# Altium schematic sheet FLEX_IO.SchDoc
size A2
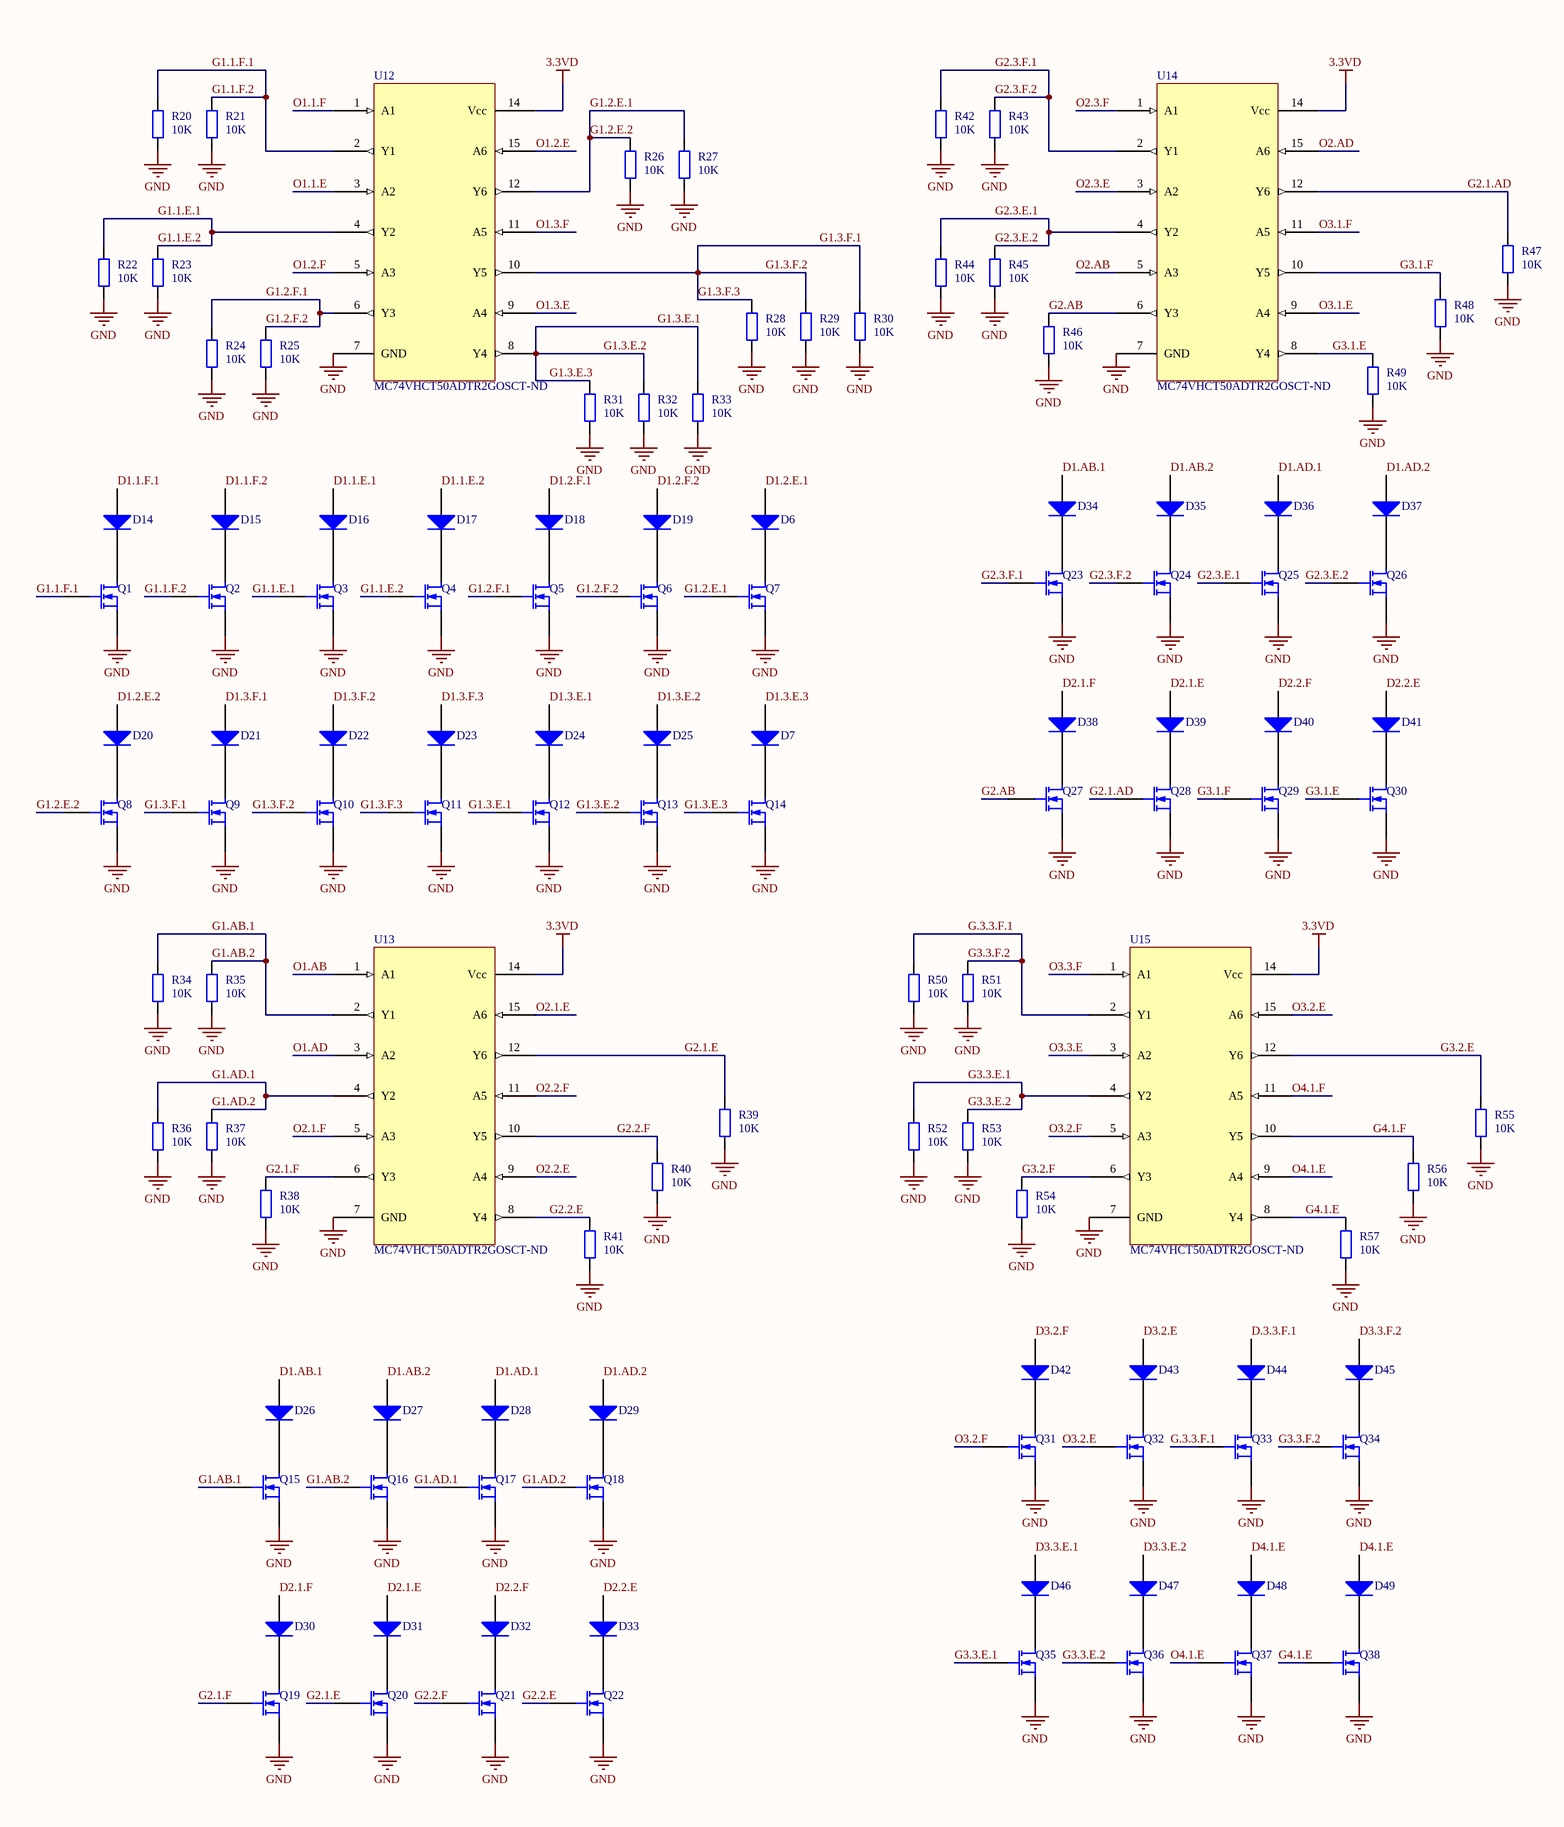
[diagram p0: FLEX_IO.SchDoc, left]
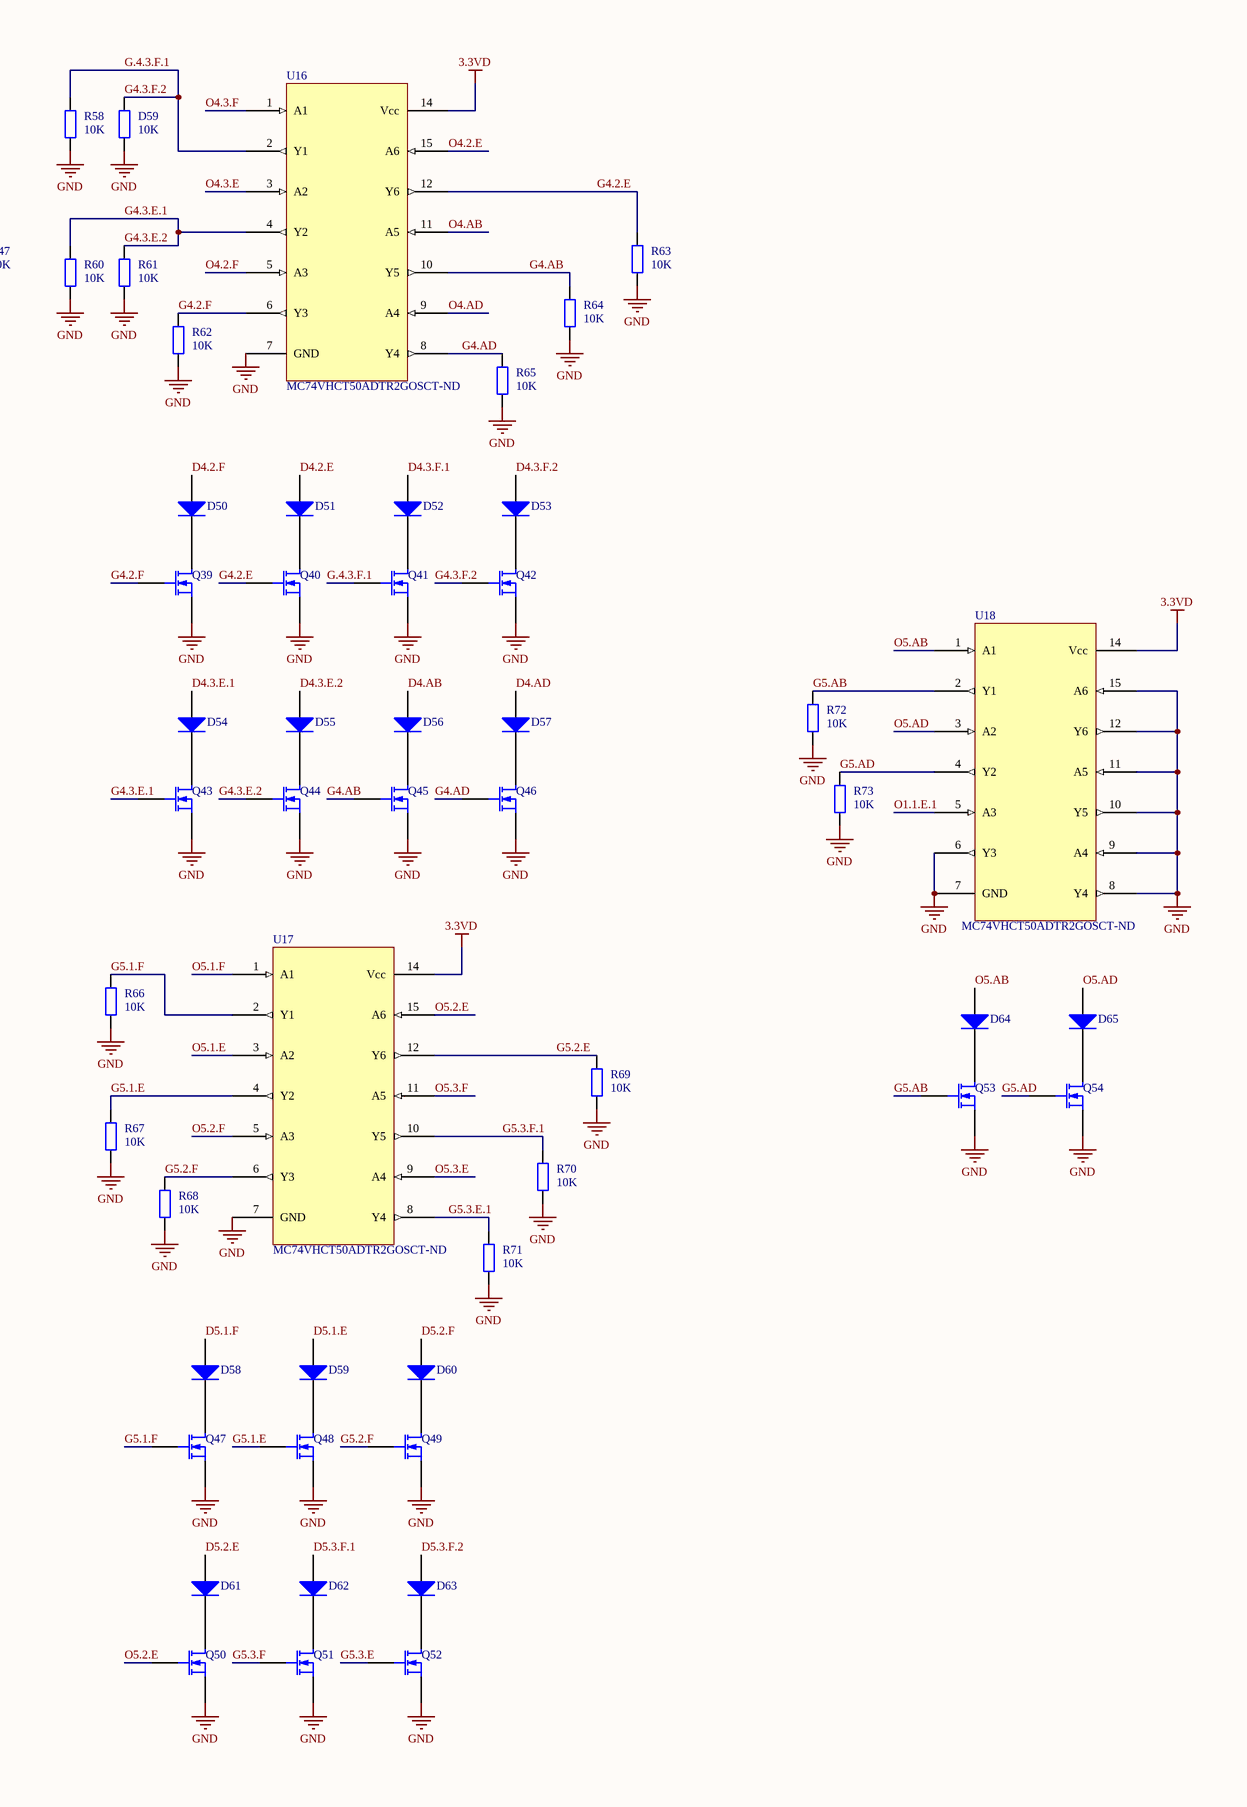
[diagram p1: FLEX_IO.SchDoc, right]

## Parts
(Parts that share a designator on the sheet are numbered #1, #2 ... from top to bottom, then left to right.)
D6  de  [SMC]  (value not drawn)
D7  de  [SMC]  (value not drawn)
D14  de  [SMC]  (value not drawn)
D15  de  [SMC]  (value not drawn)
D16  de  [SMC]  (value not drawn)
D17  de  [SMC]  (value not drawn)
D18  de  [SMC]  (value not drawn)
D19  de  [SMC]  (value not drawn)
D20  de  [SMC]  (value not drawn)
D21  de  [SMC]  (value not drawn)
D22  de  [SMC]  (value not drawn)
D23  de  [SMC]  (value not drawn)
D24  de  [SMC]  (value not drawn)
D25  de  [SMC]  (value not drawn)
D26  de  [SMC]  (value not drawn)
D27  de  [SMC]  (value not drawn)
D28  de  [SMC]  (value not drawn)
D29  de  [SMC]  (value not drawn)
D30  de  [SMC]  (value not drawn)
D31  de  [SMC]  (value not drawn)
D32  de  [SMC]  (value not drawn)
D33  de  [SMC]  (value not drawn)
D34  de  [SMC]  (value not drawn)
D35  de  [SMC]  (value not drawn)
D36  de  [SMC]  (value not drawn)
D37  de  [SMC]  (value not drawn)
D38  de  [SMC]  (value not drawn)
D39  de  [SMC]  (value not drawn)
D40  de  [SMC]  (value not drawn)
D41  de  [SMC]  (value not drawn)
D42  de  [SMC]  (value not drawn)
D43  de  [SMC]  (value not drawn)
D44  de  [SMC]  (value not drawn)
D45  de  [SMC]  (value not drawn)
D46  de  [SMC]  (value not drawn)
D47  de  [SMC]  (value not drawn)
D48  de  [SMC]  (value not drawn)
D49  de  [SMC]  (value not drawn)
D50  de  [SMC]  (value not drawn)
D51  de  [SMC]  (value not drawn)
D52  de  [SMC]  (value not drawn)
D53  de  [SMC]  (value not drawn)
D54  de  [SMC]  (value not drawn)
D55  de  [SMC]  (value not drawn)
D56  de  [SMC]  (value not drawn)
D57  de  [SMC]  (value not drawn)
D58  de  [SMC]  (value not drawn)
D59#1  value 10K  [AXIAL-0.4]
D59#2  de  [SMC]  (value not drawn)
D60  de  [SMC]  (value not drawn)
D61  de  [SMC]  (value not drawn)
D62  de  [SMC]  (value not drawn)
D63  de  [SMC]  (value not drawn)
D64  de  [SMC]  (value not drawn)
D65  de  [SMC]  (value not drawn)
Q1  (no value)
Q2  (no value)
Q3  (no value)
Q4  (no value)
Q5  (no value)
Q6  (no value)
Q7  (no value)
Q8  (no value)
Q9  (no value)
Q10  (no value)
Q11  (no value)
Q12  (no value)
Q13  (no value)
Q14  (no value)
Q15  (no value)
Q16  (no value)
Q17  (no value)
Q18  (no value)
Q19  (no value)
Q20  (no value)
Q21  (no value)
Q22  (no value)
Q23  (no value)
Q24  (no value)
Q25  (no value)
Q26  (no value)
Q27  (no value)
Q28  (no value)
Q29  (no value)
Q30  (no value)
Q31  (no value)
Q32  (no value)
Q33  (no value)
Q34  (no value)
Q35  (no value)
Q36  (no value)
Q37  (no value)
Q38  (no value)
Q39  (no value)
Q40  (no value)
Q41  (no value)
Q42  (no value)
Q43  (no value)
Q44  (no value)
Q45  (no value)
Q46  (no value)
Q47  (no value)
Q48  (no value)
Q49  (no value)
Q50  (no value)
Q51  (no value)
Q52  (no value)
Q53  (no value)
Q54  (no value)
R20  value 10K  [AXIAL-0.4]
R21  value 10K  [AXIAL-0.4]
R22  value 10K  [AXIAL-0.4]
R23  value 10K  [AXIAL-0.4]
R24  value 10K  [AXIAL-0.4]
R25  value 10K  [AXIAL-0.4]
R26  value 10K  [AXIAL-0.4]
R27  value 10K  [AXIAL-0.4]
R28  value 10K  [AXIAL-0.4]
R29  value 10K  [AXIAL-0.4]
R30  value 10K  [AXIAL-0.4]
R31  value 10K  [AXIAL-0.4]
R32  value 10K  [AXIAL-0.4]
R33  value 10K  [AXIAL-0.4]
R34  value 10K  [AXIAL-0.4]
R35  value 10K  [AXIAL-0.4]
R36  value 10K  [AXIAL-0.4]
R37  value 10K  [AXIAL-0.4]
R38  value 10K  [AXIAL-0.4]
R39  value 10K  [AXIAL-0.4]
R40  value 10K  [AXIAL-0.4]
R41  value 10K  [AXIAL-0.4]
R42  value 10K  [AXIAL-0.4]
R43  value 10K  [AXIAL-0.4]
R44  value 10K  [AXIAL-0.4]
R45  value 10K  [AXIAL-0.4]
R46  value 10K  [AXIAL-0.4]
R47  value 10K  [AXIAL-0.4]
R48  value 10K  [AXIAL-0.4]
R49  value 10K  [AXIAL-0.4]
R50  value 10K  [AXIAL-0.4]
R51  value 10K  [AXIAL-0.4]
R52  value 10K  [AXIAL-0.4]
R53  value 10K  [AXIAL-0.4]
R54  value 10K  [AXIAL-0.4]
R55  value 10K  [AXIAL-0.4]
R56  value 10K  [AXIAL-0.4]
R57  value 10K  [AXIAL-0.4]
R58  value 10K  [AXIAL-0.4]
R60  value 10K  [AXIAL-0.4]
R61  value 10K  [AXIAL-0.4]
R62  value 10K  [AXIAL-0.4]
R63  value 10K  [AXIAL-0.4]
R64  value 10K  [AXIAL-0.4]
R65  value 10K  [AXIAL-0.4]
R66  value 10K  [AXIAL-0.4]
R67  value 10K  [AXIAL-0.4]
R68  value 10K  [AXIAL-0.4]
R69  value 10K  [AXIAL-0.4]
R70  value 10K  [AXIAL-0.4]
R71  value 10K  [AXIAL-0.4]
R72  value 10K  [AXIAL-0.4]
R73  value 10K  [AXIAL-0.4]
U12  Supplier Part Number 1: MC74VHCT50ADTR2GOSCT-ND  (hidden comment: MC74VHCT50A)
U13  Supplier Part Number 1: MC74VHCT50ADTR2GOSCT-ND  (hidden comment: MC74VHCT50A)
U14  Supplier Part Number 1: MC74VHCT50ADTR2GOSCT-ND  (hidden comment: MC74VHCT50A)
U15  Supplier Part Number 1: MC74VHCT50ADTR2GOSCT-ND  (hidden comment: MC74VHCT50A)
U16  Supplier Part Number 1: MC74VHCT50ADTR2GOSCT-ND  (hidden comment: MC74VHCT50A)
U17  Supplier Part Number 1: MC74VHCT50ADTR2GOSCT-ND  (hidden comment: MC74VHCT50A)
U18  Supplier Part Number 1: MC74VHCT50ADTR2GOSCT-ND  (hidden comment: MC74VHCT50A)

## Nets
3.3VD: U12.14(Vcc) U13.14(Vcc) U14.14(Vcc) U15.14(Vcc) U16.14(Vcc) U17.14(Vcc) U18.14(Vcc)
GND: D59#1.1 Q1.3(S) Q2.3(S) Q3.3(S) Q4.3(S) Q5.3(S) Q6.3(S) Q7.3(S) Q8.3(S) Q9.3(S) Q10.3(S) Q11.3(S) Q12.3(S) Q13.3(S) Q14.3(S) Q15.3(S) Q16.3(S) Q17.3(S) Q18.3(S) Q19.3(S) Q20.3(S) Q21.3(S) Q22.3(S) Q23.3(S) Q24.3(S) Q25.3(S) Q26.3(S) Q27.3(S) Q28.3(S) Q29.3(S) Q30.3(S) Q31.3(S) Q32.3(S) Q33.3(S) Q34.3(S) Q35.3(S) Q36.3(S) Q37.3(S) Q38.3(S) Q39.3(S) Q40.3(S) Q41.3(S) Q42.3(S) Q43.3(S) Q44.3(S) Q45.3(S) Q46.3(S) Q47.3(S) Q48.3(S) Q49.3(S) Q50.3(S) Q51.3(S) Q52.3(S) Q53.3(S) Q54.3(S) R20.1 R21.1 R22.1 R23.1 R24.1 R25.1 R26.1 R27.1 R28.1 R29.1 R30.1 R31.1 R32.1 R33.1 R34.1 R35.1 R36.1 R37.1 R38.1 R39.1 R40.1 R41.1 R42.1 R43.1 R44.1 R45.1 R46.1 R47.1 R48.1 R49.1 R50.1 R51.1 R52.1 R53.1 R54.1 R55.1 R56.1 R57.1 R58.1 R60.1 R61.1 R62.1 R63.1 R64.1 R65.1 R66.1 R67.1 R68.1 R69.1 R70.1 R71.1 R72.1 R73.1 U12.7(GND) U13.7(GND) U14.7(GND) U15.7(GND) U16.7(GND) U17.7(GND) U18.6(Y3) U18.7(GND) U18.8(Y4) U18.9(A4) U18.10(Y5) U18.11(A5) U18.12(Y6) U18.15(A6)
D1.1.E.1: D16.1(A)
D1.1.E.2: D17.1(A)
D1.1.F.1: D14.1(A)
D1.1.F.2: D15.1(A)
D1.2.E.1: D6.1(A)
D1.2.E.2: D20.1(A)
D1.2.F.1: D18.1(A)
D1.2.F.2: D19.1(A)
D1.3.E.1: D24.1(A)
D1.3.E.2: D25.1(A)
D1.3.E.3: D7.1(A)
D1.3.F.1: D21.1(A)
D1.3.F.2: D22.1(A)
D1.3.F.3: D23.1(A)
D1.AB.1: D26.1(A) D34.1(A)
D1.AB.2: D27.1(A) D35.1(A)
D1.AD.1: D28.1(A) D36.1(A)
D1.AD.2: D29.1(A) D37.1(A)
D2.1.E: D31.1(A) D39.1(A)
D2.1.F: D30.1(A) D38.1(A)
D2.2.E: D33.1(A) D41.1(A)
D2.2.F: D32.1(A) D40.1(A)
D3.2.E: D43.1(A)
D3.2.F: D42.1(A)
D3.3.E.1: D46.1(A)
D3.3.E.2: D47.1(A)
D3.3.F.2: D45.1(A)
D4.1.E: D48.1(A) D49.1(A)
D4.2.E: D51.1(A)
D4.2.F: D50.1(A)
D4.3.E.1: D54.1(A)
D4.3.E.2: D55.1(A)
D4.3.F.1: D52.1(A)
D4.3.F.2: D53.1(A)
D4.AB: D56.1(A)
D4.AD: D57.1(A)
D5.1.E: D59#2.1(A)
D5.1.F: D58.1(A)
D5.2.E: D61.1(A)
D5.2.F: D60.1(A)
D5.3.F.1: D62.1(A)
D5.3.F.2: D63.1(A)
D.3.3.F.1: D44.1(A)
G1.1.E.1: Q3.2(G) Q4.2(G) R22.2 R23.2 U12.4(Y2)  [also labelled G1.1.E.2]
G1.1.F.1: Q1.2(G) Q2.2(G) R20.2 R21.2 U12.2(Y1)  [also labelled G1.1.F.2]
G1.2.E.1: Q7.2(G) Q8.2(G) R26.2 R27.2 U12.12(Y6)  [also labelled G1.2.E.2]
G1.2.F.1: Q5.2(G) Q6.2(G) R24.2 R25.2 U12.6(Y3)  [also labelled G1.2.F.2]
G1.3.E.1: Q12.2(G) Q13.2(G) Q14.2(G) R31.2 R32.2 R33.2 U12.8(Y4)  [also labelled G1.3.E.2, G1.3.E.3]
G1.3.F.1: Q9.2(G) Q10.2(G) Q11.2(G) R28.2 R29.2 R30.2 U12.10(Y5)  [also labelled G1.3.F.2, G1.3.F.3]
G1.AB.1: Q15.2(G) Q16.2(G) R34.2 R35.2 U13.2(Y1)  [also labelled G1.AB.2]
G1.AD.1: Q17.2(G) Q18.2(G) R36.2 R37.2 U13.4(Y2)  [also labelled G1.AD.2]
G2.1.AD: Q28.2(G) R47.2 U14.12(Y6)
G2.1.E: Q20.2(G) R39.2 U13.12(Y6)
G2.1.F: Q19.2(G) R38.2 U13.6(Y3)
G2.2.E: Q22.2(G) R41.2 U13.8(Y4)
G2.2.F: Q21.2(G) R40.2 U13.10(Y5)
G2.3.E.1: Q25.2(G) Q26.2(G) R44.2 R45.2 U14.4(Y2)  [also labelled G2.3.E.2]
G2.3.F.1: Q23.2(G) Q24.2(G) R42.2 R43.2 U14.2(Y1)  [also labelled G2.3.F.2]
G2.AB: Q27.2(G) R46.2 U14.6(Y3)
G3.1.E: Q30.2(G) R49.2 U14.8(Y4)
G3.1.F: Q29.2(G) R48.2 U14.10(Y5)
G3.2.E: R55.2 U15.12(Y6)
G3.2.F: R54.2 U15.6(Y3)
G3.3.E.1: Q35.2(G) Q36.2(G) R52.2 R53.2 U15.4(Y2)  [also labelled G3.3.E.2]
G4.1.E: Q38.2(G) R57.2 U15.8(Y4)
G4.1.F: R56.2 U15.10(Y5)
G4.2.E: Q40.2(G) R63.2 U16.12(Y6)
G4.2.F: Q39.2(G) R62.2 U16.6(Y3)
G4.3.E.1: Q43.2(G) Q44.2(G) R60.2 R61.2 U16.4(Y2)  [also labelled G4.3.E.2]
G4.AB: Q45.2(G) R64.2 U16.10(Y5)
G4.AD: Q46.2(G) R65.2 U16.8(Y4)
G5.1.E: Q48.2(G) R67.2 U17.4(Y2)
G5.1.F: Q47.2(G) R66.2 U17.2(Y1)
G5.2.E: R69.2 U17.12(Y6)
G5.2.F: Q49.2(G) R68.2 U17.6(Y3)
G5.3.E: Q52.2(G)
G5.3.E.1: R71.2 U17.8(Y4)
G5.3.F: Q51.2(G)
G5.3.F.1: R70.2 U17.10(Y5)
G5.AB: Q53.2(G) R72.2 U18.2(Y1)
G5.AD: Q54.2(G) R73.2 U18.4(Y2)
G.3.3.F.1: Q33.2(G) Q34.2(G) R50.2 R51.2 U15.2(Y1)  [also labelled G3.3.F.2]
G.4.3.F.1: D59#1.2 Q41.2(G) Q42.2(G) R58.2 U16.2(Y1)  [also labelled G4.3.F.2]
O1.1.E: U12.3(A2)
O1.1.E.1: U18.5(A3)
O1.1.F: U12.1(A1)
O1.2.E: U12.15(A6)
O1.2.F: U12.5(A3)
O1.3.E: U12.9(A4)
O1.3.F: U12.11(A5)
O1.AB: U13.1(A1)
O1.AD: U13.3(A2)
O2.1.E: U13.15(A6)
O2.1.F: U13.5(A3)
O2.2.E: U13.9(A4)
O2.2.F: U13.11(A5)
O2.3.E: U14.3(A2)
O2.3.F: U14.1(A1)
O2.AB: U14.5(A3)
O2.AD: U14.15(A6)
O3.1.E: U14.9(A4)
O3.1.F: U14.11(A5)
O3.2.E: Q32.2(G) U15.15(A6)
O3.2.F: Q31.2(G) U15.5(A3)
O3.3.E: U15.3(A2)
O3.3.F: U15.1(A1)
O4.1.E: Q37.2(G) U15.9(A4)
O4.1.F: U15.11(A5)
O4.2.E: U16.15(A6)
O4.2.F: U16.5(A3)
O4.3.E: U16.3(A2)
O4.3.F: U16.1(A1)
O4.AB: U16.11(A5)
O4.AD: U16.9(A4)
O5.1.E: U17.3(A2)
O5.1.F: U17.1(A1)
O5.2.E: Q50.2(G) U17.15(A6)
O5.2.F: U17.5(A3)
O5.3.E: U17.9(A4)
O5.3.F: U17.11(A5)
O5.AB: D64.1(A) U18.1(A1)
O5.AD: D65.1(A) U18.3(A2)
NetD6_2: D6.2(K) Q7.1(D)
NetD7_2: D7.2(K) Q14.1(D)
NetD14_2: D14.2(K) Q1.1(D)
NetD15_2: D15.2(K) Q2.1(D)
NetD16_2: D16.2(K) Q3.1(D)
NetD17_2: D17.2(K) Q4.1(D)
NetD18_2: D18.2(K) Q5.1(D)
NetD19_2: D19.2(K) Q6.1(D)
NetD20_2: D20.2(K) Q8.1(D)
NetD21_2: D21.2(K) Q9.1(D)
NetD22_2: D22.2(K) Q10.1(D)
NetD23_2: D23.2(K) Q11.1(D)
NetD24_2: D24.2(K) Q12.1(D)
NetD25_2: D25.2(K) Q13.1(D)
NetD26_2: D26.2(K) Q15.1(D)
NetD27_2: D27.2(K) Q16.1(D)
NetD28_2: D28.2(K) Q17.1(D)
NetD29_2: D29.2(K) Q18.1(D)
NetD30_2: D30.2(K) Q19.1(D)
NetD31_2: D31.2(K) Q20.1(D)
NetD32_2: D32.2(K) Q21.1(D)
NetD33_2: D33.2(K) Q22.1(D)
NetD34_2: D34.2(K) Q23.1(D)
NetD35_2: D35.2(K) Q24.1(D)
NetD36_2: D36.2(K) Q25.1(D)
NetD37_2: D37.2(K) Q26.1(D)
NetD38_2: D38.2(K) Q27.1(D)
NetD39_2: D39.2(K) Q28.1(D)
NetD40_2: D40.2(K) Q29.1(D)
NetD41_2: D41.2(K) Q30.1(D)
NetD42_2: D42.2(K) Q31.1(D)
NetD43_2: D43.2(K) Q32.1(D)
NetD44_2: D44.2(K) Q33.1(D)
NetD45_2: D45.2(K) Q34.1(D)
NetD46_2: D46.2(K) Q35.1(D)
NetD47_2: D47.2(K) Q36.1(D)
NetD48_2: D48.2(K) Q37.1(D)
NetD49_2: D49.2(K) Q38.1(D)
NetD50_2: D50.2(K) Q39.1(D)
NetD51_2: D51.2(K) Q40.1(D)
NetD52_2: D52.2(K) Q41.1(D)
NetD53_2: D53.2(K) Q42.1(D)
NetD54_2: D54.2(K) Q43.1(D)
NetD55_2: D55.2(K) Q44.1(D)
NetD56_2: D56.2(K) Q45.1(D)
NetD57_2: D57.2(K) Q46.1(D)
NetD58_2: D58.2(K) Q47.1(D)
NetD59#2_2: D59#2.2(K) Q48.1(D)
NetD60_2: D60.2(K) Q49.1(D)
NetD61_2: D61.2(K) Q50.1(D)
NetD62_2: D62.2(K) Q51.1(D)
NetD63_2: D63.2(K) Q52.1(D)
NetD64_2: D64.2(K) Q53.1(D)
NetD65_2: D65.2(K) Q54.1(D)

## Library data of the parts
D6 D7 D14-D58 D59#2 D60-D65 = Diode: Default Diode; Published: 8-Jun-2000; LatestRevisionDate: 17-Jul-2002; LatestRevisionNote: Re-released for DXP Platform.; PackageVersion: Sep-1996; PackageReference: SMC; Publisher: Altium Limited; PackageDescription: DO-214-AB/SMC; 2 C-Bend Leads; Body 7.9 x 5.9 mm, inc. leads (LxW); Code_JEDEC: DO-214-AB; Supplier 1: Digi-Key; Supplier Part Number 1: 1727-5384-1-ND
D59#1 R20-R58 R60-R73 = Res2: Resistor; Published: 8-Jun-2000; LatestRevisionDate: 17-Jul-2002; LatestRevisionNote: Re-released for DXP Platform.; PackageReference: AXIAL-0.4; Publisher: Altium Limited; PackageDescription: Axial Device, Thru-Hole; 2 Leads; 0.4 in Pin Spacing; Supplier 1: Digi-Key; Supplier 2: Digi-Key; Supplier Part Number 2: P10.0KHCT-ND
Q1-Q54 = MOSFET-N: N-Channel MOSFET; Published: 8-Jun-2000; LatestRevisionDate: 17-Jul-2002; LatestRevisionNote: Re-released for DXP Platform.; PackageVersion: 1995/1996; PackageReference: E3; Publisher: Altium Limited; PackageDescription: TO, Flat Index; 3 In-Line, Axial Leads; Body Dia. 4.6mm; Lead Dia. 0.5 mm (max); Supplier 1: Digi-Key; Supplier 2: Digi-Key; Supplier Part Number 2: 497-7462-1-ND
U12-U18 = MC74VHCT50A: 6-Channel CMOS Buffer; Supplier 1: Digi-Key